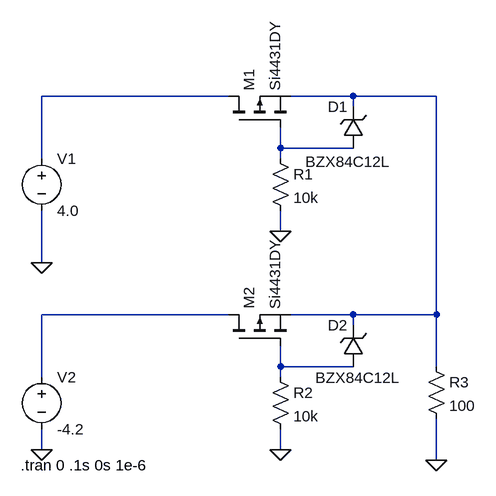
[diagram p0: schematic Power-ORing.asc]
Power-ORing.asc, the LTspice schematic file:
Version 4.1
SHEET 1 880 680
WIRE 272 -16 -16 -16
WIRE 464 -16 368 -16
WIRE 592 -16 464 -16
WIRE 464 0 464 -16
WIRE 352 64 352 32
WIRE 464 64 352 64
WIRE -16 80 -16 -16
WIRE 352 80 352 64
WIRE 352 192 352 160
WIRE -16 240 -16 160
WIRE 272 320 -16 320
WIRE 464 320 368 320
WIRE 592 320 592 -16
WIRE 592 320 464 320
WIRE 464 336 464 320
WIRE 352 400 352 368
WIRE 464 400 352 400
WIRE 592 400 592 320
WIRE -16 416 -16 320
WIRE 352 416 352 400
WIRE -16 528 -16 496
WIRE 352 528 352 496
WIRE 592 544 592 480
FLAG 352 192 0
FLAG 592 544 0
FLAG 352 528 0
FLAG -16 528 0
FLAG -16 240 0
SYMBOL voltage -16 64 R0
WINDOW 123 0 0 Left 0
WINDOW 39 0 0 Left 0
SYMATTR InstName V1
SYMATTR Value 4.0
SYMBOL pmos 272 32 R270
SYMATTR InstName M1
SYMATTR Value Si4431DY
SYMBOL res 336 64 R0
SYMATTR InstName R1
SYMATTR Value 10k
SYMBOL zener 480 64 R180
WINDOW 0 24 64 Left 2
WINDOW 3 -42 -21 Left 2
SYMATTR InstName D1
SYMATTR Value BZX84C12L
SYMBOL voltage -16 400 R0
WINDOW 123 0 0 Left 0
WINDOW 39 0 0 Left 0
SYMATTR InstName V2
SYMATTR Value -4.2
SYMBOL pmos 272 368 R270
SYMATTR InstName M2
SYMATTR Value Si4431DY
SYMBOL res 336 400 R0
SYMATTR InstName R2
SYMATTR Value 10k
SYMBOL zener 480 400 R180
WINDOW 0 24 64 Left 2
WINDOW 3 -57 -17 Left 2
SYMATTR InstName D2
SYMATTR Value BZX84C12L
SYMBOL res 576 384 R0
SYMATTR InstName R3
SYMATTR Value 100
TEXT -48 552 Left 2 !.tran 0 .1s 0s 1e-6

The netlist it stands for:
* Power-ORing.asc
V1 N001 0 4.0
M1 N001 N003 N002 N002 Si4431DY
R1 N003 0 10k
D1 N003 N002 BZX84C12L
V2 N004 0 -4.2
M2 N004 N005 N002 N002 Si4431DY
R2 N005 0 10k
D2 N005 N002 BZX84C12L
R3 N002 0 100
.model D D
.lib standard.dio
.model NMOS NMOS
.model PMOS PMOS
.lib standard.mos
.tran 0 .1s 0s 1e-6
.backanno
.end